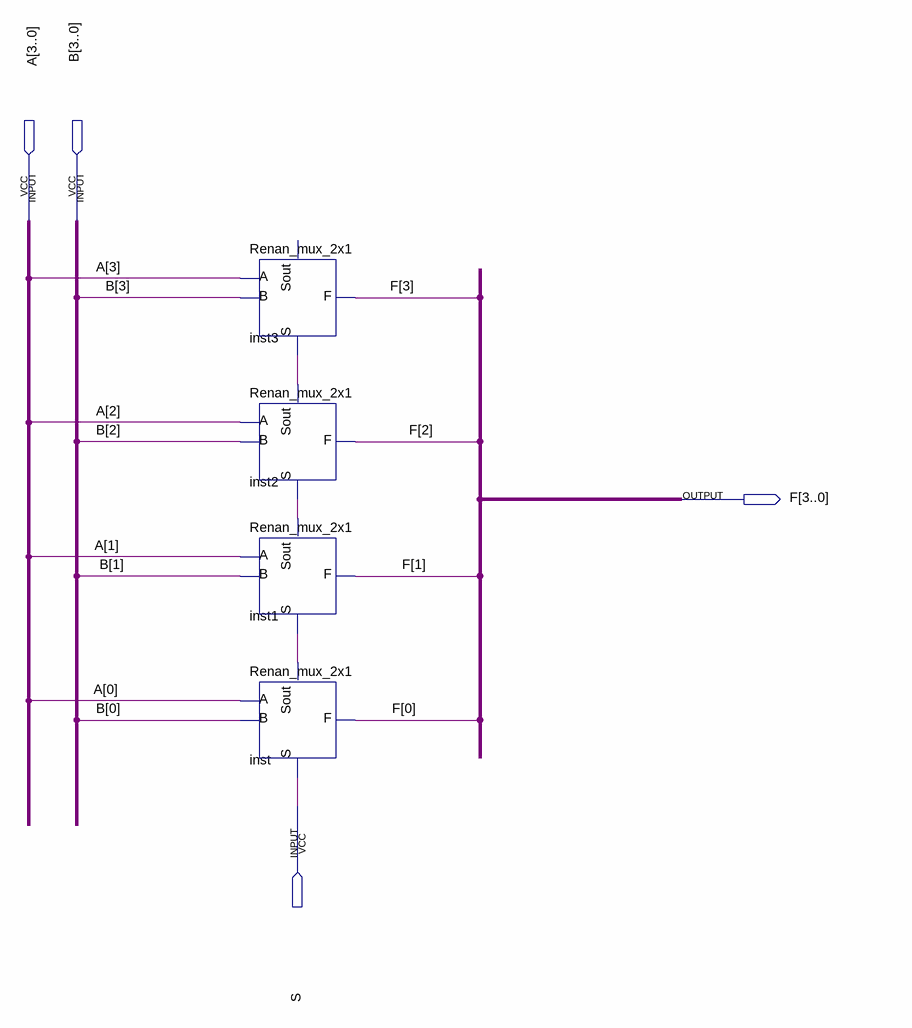
[diagram p0: schematic sheet]
// Quartus schematic mhrs_renan_2x1_total.bdf as structural Verilog: 4 symbols, 4 pins
module mhrs_renan_2x1_total (
  input  [3:0] A,
  input  [3:0] B,
  input  S,
  output [3:0] F
);

  wire inst1_sout, inst2_sout, inst_sout;

  Renan_mux_2x1 inst3 (.A(A[3]), .B(B[3]), .S(inst2_sout), .F(F[3]));  // open: Sout
  Renan_mux_2x1 inst2 (.A(A[2]), .B(B[2]), .S(inst1_sout), .Sout(inst2_sout), .F(F[2]));
  Renan_mux_2x1 inst1 (.A(A[1]), .B(B[1]), .S(inst_sout), .Sout(inst1_sout), .F(F[1]));
  Renan_mux_2x1 inst (.A(A[0]), .B(B[0]), .S(S), .Sout(inst_sout), .F(F[0]));
endmodule
